# Altium schematic sheet IP27211_IP2721.schdoc.schdoc
size 124 x 99 mm
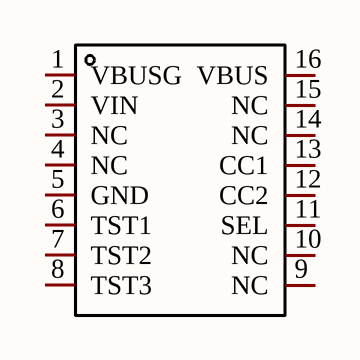
[diagram p0: IP27211_IP2721.schdoc.schdoc]

## Parts
U?  IP2721  [TSSOP-16_L5.0-W4.4-P0.65-LS6.4-BL]  (value not drawn)

## Nets

Not connected (* = marked no-connect by the designer): U? 1(VBUSG) 2(VIN) 3(NC) 4(NC) 5(GND) 6(TST1) 7(TST2) 8(TST3) 9(NC) 10(NC) 11(SEL) 12(CC2) 13(CC1) 14(NC) 15(NC) 16(VBUS)

## Library data of the parts
U? = IP2721: Manufacturer: INJOINIC(英集芯); Add into BOM: yes; Symbol: IP2721; Device: IP2721; LCSC Part Name: IP2721; Supplier Part: C603176; Manufacturer Part: IP2721; Supplier Footprint: TSSOP-16; JLCPCB Part Class: Extended Part; Datasheet: https://atta.szlcsc.com/upload/public/pdf/source/20200610/C603176_729C2C55A9E6451BDA9FCB913350E23E.pdf; Supplier: LCSC; Convert to PCB: yes